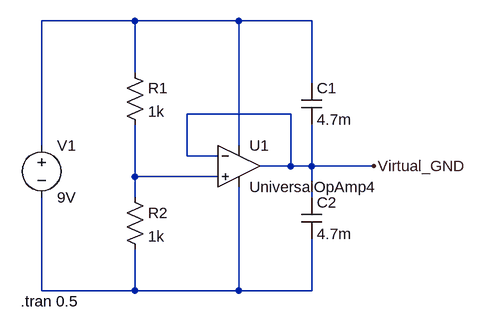
[diagram p0: schematic Draft2.asc]
Draft2.asc, the LTspice schematic file:
Version 4.1
SHEET 1 880 680
WIRE 176 -112 32 -112
WIRE 336 -112 176 -112
WIRE 448 -112 336 -112
WIRE 176 -32 176 -112
WIRE 448 -16 448 -112
WIRE 416 32 256 32
WIRE 32 80 32 -112
WIRE 336 80 336 -112
WIRE 256 96 256 32
WIRE 304 96 256 96
WIRE 416 112 416 32
WIRE 416 112 368 112
WIRE 448 112 448 48
WIRE 448 112 416 112
WIRE 544 112 448 112
WIRE 176 128 176 48
WIRE 304 128 176 128
WIRE 176 160 176 128
WIRE 448 160 448 112
WIRE 32 304 32 160
WIRE 176 304 176 240
WIRE 176 304 32 304
WIRE 336 304 336 144
WIRE 336 304 176 304
WIRE 448 304 448 224
WIRE 448 304 336 304
FLAG 544 112 Virtual_GND
SYMBOL voltage 32 64 R0
WINDOW 123 0 0 Left 0
WINDOW 39 0 0 Left 0
SYMATTR InstName V1
SYMATTR Value 9V
SYMBOL res 160 -48 R0
SYMATTR InstName R1
SYMATTR Value 1k
SYMBOL res 160 144 R0
SYMATTR InstName R2
SYMATTR Value 1k
SYMBOL cap 432 -16 R0
SYMATTR InstName C1
SYMATTR Value 4.7m
SYMBOL cap 432 160 R0
SYMATTR InstName C2
SYMATTR Value 4.7m
SYMBOL OpAmps\\UniversalOpAmp4 336 112 R0
SYMATTR InstName U1
TEXT 0 320 Left 2 !.tran 0.5

The netlist it stands for:
* Draft2.asc
V1 N001 N003 9V
R1 N001 N002 1k
R2 N002 N003 1k
C1 N001 Virtual_GND 4.7m
C2 Virtual_GND N003 4.7m
* U1: UniversalOpAmp4 (symbol OpAmps\UniversalOpAmp4 not available, pins judged from their places): In+=N002 In-=Virtual_GND V+=N001 V-=N003 OUT=Virtual_GND
.tran 0.5
.backanno
.end